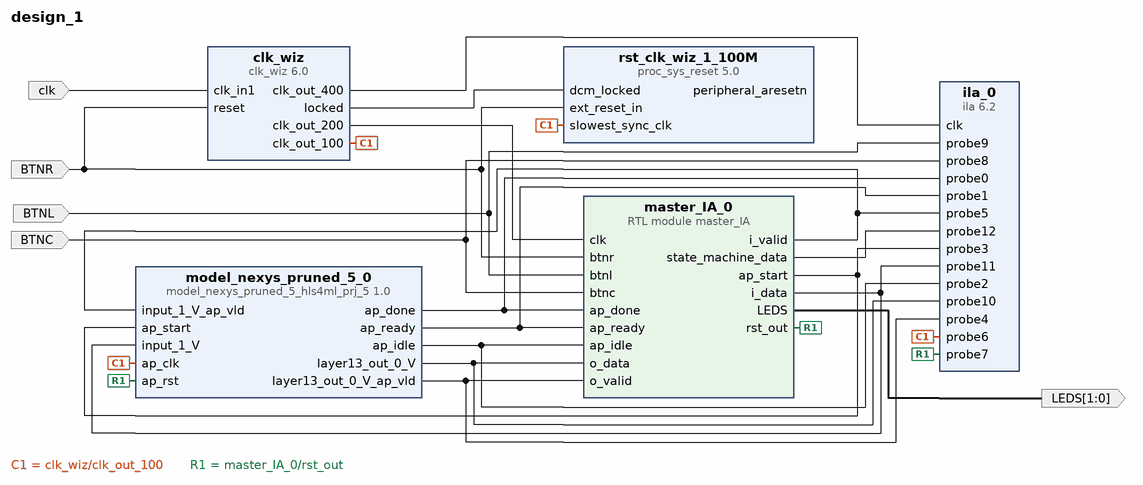
[diagram p0: block diagram of the top level]
# Vivado block design design_1, xc7a100tcsg324-1, Vivado 2019.2
create_bd_design design_1

create_bd_port -dir I BTNR
create_bd_port -dir I BTNC
create_bd_port -dir I BTNL
create_bd_port -dir I -type clk clk
set_property -dict {CONFIG.FREQ_HZ 100000000} [get_bd_ports clk]
create_bd_port -dir O -from 1 -to 0 LEDS

create_bd_cell -type ip -vlnv xilinx.com:hls:model_nexys_pruned_5_hls4ml_prj_5:1.0 model_nexys_pruned_5_0
create_bd_cell -type ip -vlnv xilinx.com:ip:ila:6.2 ila_0
set_property -dict [list \
  CONFIG.C_ENABLE_ILA_AXI_MON false \
  CONFIG.C_MONITOR_TYPE Native \
  CONFIG.C_NUM_OF_PROBES 13 \
  CONFIG.C_PROBE10_WIDTH 16 \
  CONFIG.C_PROBE11_WIDTH 32 \
  CONFIG.C_PROBE12_WIDTH 8 \
] [get_bd_cells ila_0]
create_bd_cell -type ip -vlnv xilinx.com:ip:clk_wiz:6.0 clk_wiz
set_property -dict [list \
  CONFIG.CLKOUT1_JITTER 144.719 \
  CONFIG.CLKOUT1_PHASE_ERROR 114.212 \
  CONFIG.CLKOUT1_USED true \
  CONFIG.CLKOUT2_JITTER 126.455 \
  CONFIG.CLKOUT2_PHASE_ERROR 114.212 \
  CONFIG.CLKOUT2_REQUESTED_OUT_FREQ 200.000 \
  CONFIG.CLKOUT2_USED true \
  CONFIG.CLKOUT3_JITTER 111.164 \
  CONFIG.CLKOUT3_PHASE_ERROR 114.212 \
  CONFIG.CLKOUT3_REQUESTED_OUT_FREQ 400.000 \
  CONFIG.CLKOUT3_USED true \
  CONFIG.CLK_IN1_BOARD_INTERFACE sys_clock \
  CONFIG.CLK_OUT1_PORT clk_out_100 \
  CONFIG.CLK_OUT2_PORT clk_out_200 \
  CONFIG.CLK_OUT3_PORT clk_out_400 \
  CONFIG.MMCM_CLKFBOUT_MULT_F 8.000 \
  CONFIG.MMCM_CLKOUT0_DIVIDE_F 8.000 \
  CONFIG.MMCM_CLKOUT1_DIVIDE 4 \
  CONFIG.MMCM_CLKOUT2_DIVIDE 2 \
  CONFIG.NUM_OUT_CLKS 3 \
  CONFIG.RESET_BOARD_INTERFACE reset \
  CONFIG.USE_BOARD_FLOW true \
] [get_bd_cells clk_wiz]
create_bd_cell -type ip -vlnv xilinx.com:ip:proc_sys_reset:5.0 rst_clk_wiz_1_100M
set_property -dict {CONFIG.RESET_BOARD_INTERFACE reset CONFIG.USE_BOARD_FLOW true} [get_bd_cells rst_clk_wiz_1_100M]
create_bd_cell -type module -reference master_IA master_IA_0

# ---- connections ----

# net rst_clk_wiz_1_100M_peripheral_aresetn has one end: rst_clk_wiz_1_100M/peripheral_aresetn
connect_bd_net [get_bd_pins clk_wiz/clk_out_200] [get_bd_pins master_IA_0/clk]
connect_bd_net [get_bd_pins clk_wiz/clk_out_400] [get_bd_pins ila_0/clk]
connect_bd_net [get_bd_pins clk_wiz/clk_out_100] \
  [get_bd_pins ila_0/probe6] [get_bd_pins model_nexys_pruned_5_0/ap_clk] [get_bd_pins rst_clk_wiz_1_100M/slowest_sync_clk]
connect_bd_net [get_bd_pins clk_wiz/locked] [get_bd_pins rst_clk_wiz_1_100M/dcm_locked]
connect_bd_net [get_bd_ports clk] [get_bd_pins clk_wiz/clk_in1]
connect_bd_net [get_bd_ports BTNR] [get_bd_pins clk_wiz/reset] [get_bd_pins rst_clk_wiz_1_100M/ext_reset_in] [get_bd_pins master_IA_0/btnr]
connect_bd_net [get_bd_ports BTNL] [get_bd_pins ila_0/probe9] [get_bd_pins master_IA_0/btnl]
connect_bd_net [get_bd_ports BTNC] [get_bd_pins ila_0/probe8] [get_bd_pins master_IA_0/btnc]
connect_bd_net [get_bd_pins master_IA_0/LEDS] [get_bd_ports LEDS]
connect_bd_net [get_bd_pins model_nexys_pruned_5_0/ap_done] [get_bd_pins ila_0/probe0] [get_bd_pins master_IA_0/ap_done]
connect_bd_net [get_bd_pins model_nexys_pruned_5_0/ap_ready] [get_bd_pins ila_0/probe1] [get_bd_pins master_IA_0/ap_ready]
connect_bd_net [get_bd_pins model_nexys_pruned_5_0/ap_idle] [get_bd_pins ila_0/probe2] [get_bd_pins master_IA_0/ap_idle]
connect_bd_net [get_bd_pins model_nexys_pruned_5_0/layer13_out_0_V] [get_bd_pins ila_0/probe10] [get_bd_pins master_IA_0/o_data]
connect_bd_net [get_bd_pins master_IA_0/i_valid] [get_bd_pins model_nexys_pruned_5_0/input_1_V_ap_vld] [get_bd_pins ila_0/probe5]
connect_bd_net [get_bd_pins master_IA_0/ap_start] [get_bd_pins model_nexys_pruned_5_0/ap_start] [get_bd_pins ila_0/probe3]
connect_bd_net [get_bd_pins model_nexys_pruned_5_0/layer13_out_0_V_ap_vld] [get_bd_pins ila_0/probe4] [get_bd_pins master_IA_0/o_valid]
connect_bd_net [get_bd_pins master_IA_0/i_data] [get_bd_pins model_nexys_pruned_5_0/input_1_V] [get_bd_pins ila_0/probe11]
connect_bd_net [get_bd_pins master_IA_0/rst_out] [get_bd_pins model_nexys_pruned_5_0/ap_rst] [get_bd_pins ila_0/probe7]
connect_bd_net [get_bd_pins master_IA_0/state_machine_data] [get_bd_pins ila_0/probe12]

validate_bd_design
save_bd_design
